# EAGLE schematic nixie-serial (EAGLE 7.2.0)
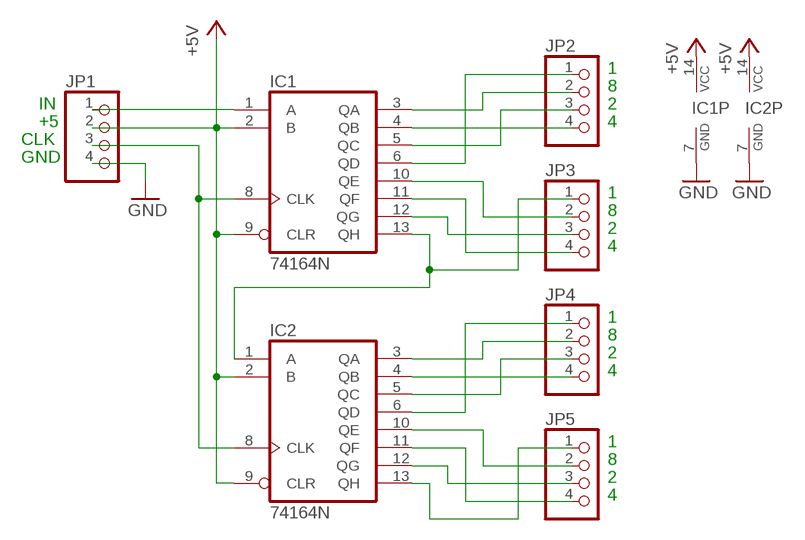
[diagram p0: schematic, sheet 1]

## Parts
IC1  74164N  [DIL14]
IC2  74164N  [DIL14]
JP1  PINHD-1X4  [1X04]
JP2  PINHD-1X4  [1X04]
JP3  PINHD-1X4  [1X04]
JP4  PINHD-1X4  [1X04]
JP5  PINHD-1X4  [1X04]

## Nets
+5V: IC1.2(B) IC1.9(CLR) IC1.14(VCC) IC2.2(B) IC2.9(CLR) IC2.14(VCC) JP1.2
GND: IC1.7(GND) IC2.7(GND) JP1.4
N$1: JP4.2
N$2: IC1.13(QH) IC2.1(A) JP3.1
N$3: IC1.1(A) JP1.1
N$4: IC1.8(CLK) IC2.8(CLK) JP1.3
N$5: JP4.4
N$6: IC1.3(QA) JP2.2
N$7: IC1.4(QB) JP2.4
N$8: IC1.5(QC) JP2.3
N$9: IC1.6(QD) JP2.1
N$10: JP4.3
N$11: JP4.1
N$12: IC1.10(QE) JP3.2
N$13: IC1.11(QF) JP3.4
N$14: IC1.12(QG) JP3.3
N$15: IC2.10(QE) JP5.2
N$16: IC2.11(QF) JP5.4
N$17: IC2.12(QG) JP5.3
N$18: IC2.13(QH) JP5.1
Unconnected: IC2.3(QA) IC2.4(QB) IC2.5(QC) IC2.6(QD)

## Notes on the sheet
- 1
- 8
- IN | 2
- +5 | 4
- CLK
- GND
- 1
- 8
- 2
- 4
- 1
- 8
- 2
- 4
- 1
- 8
- 2
- 4

## Library data of the parts
IC1 IC2 = 74xx-eu:74*164: 8-bit parallel out SHIFT REGISTER
JP1-JP5 = pinhead:PINHD-1X4: PIN HEADER